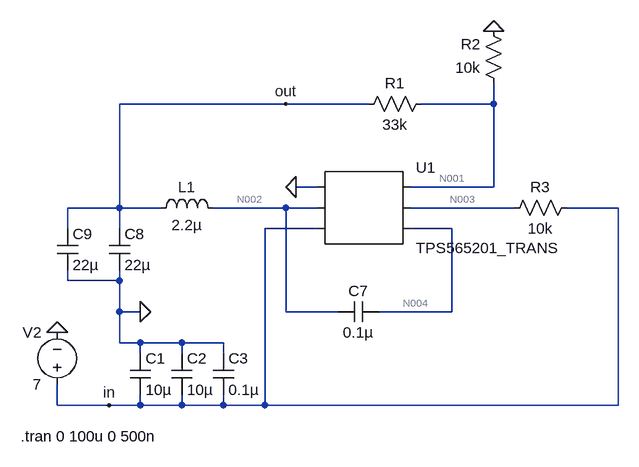
[diagram p0: schematic Voltage_Reg_3-3V.asc]
* Voltage_Reg_3-3V.asc
* U1: TPS565201_TRANS (symbol AutoGenerated\TPS565201_TRANS not available, pins judged from their places): pin1=0 pin2=N002 pin3=in pin4=N001 pin5=N003 pin6=N004
L1 out N002 2.2µ Rser=1u
C1 0 in 10µ
C2 0 in 10µ
C3 0 in 0.1µ
R3 in N003 10k
R1 N001 out 33k
C7 N004 N002 0.1µ
C9 out 0 22µ
C8 out 0 22µ
R2 N001 0 10k
V2 in 0 7
.tran 0 100u 0 500n
.backanno
.end

* Results of the author's LTspice run, read from the files saved beside the schematic
* Operating Point, zero values left out:
*   V(in) = 7 V
*   V(n003) = 7 V
*   V(n002) = 2.912 mV
*   V(n004) = 7 V
*   V(out) = 2.912 mV
*   V(n001) = 677.2 µV
*   I(L1) = -67.72 nA
*   I(R1) = -67.72 nA
*   I(R2) = 67.72 nA
*   I(V2) = -69.99 nA
*   Ix(u1:GND) = -7.28 nA
*   Ix(u1:SW) = -67.72 nA
*   Ix(u1:VIN) = 69.99 nA
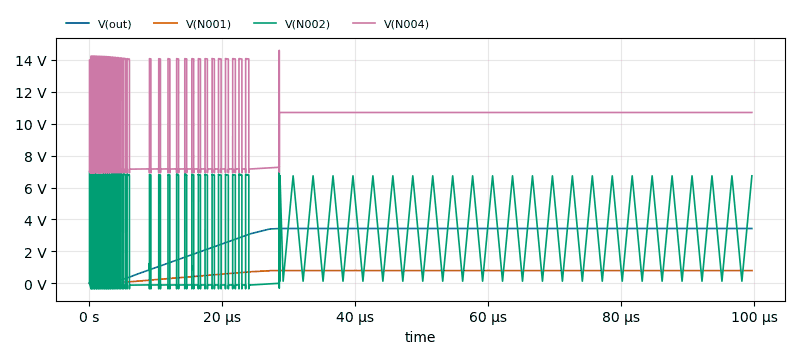
[diagram p1: Transient Analysis of Voltage_Reg_3-3V.asc, plotted from the saved traces]
* Transient Analysis, 1 run:
*   V(out): min 2.912 mV, max 3.434 V, average 2.923 V, rms 3.094 V, last 3.433 V
*   V(N001): min 677.2 µV, max 798.5 mV, average 679.7 mV, rms 719.5 mV, last 798.5 mV
*   V(N002): min -344.4 mV, max 7.326 V, average 2.923 V, rms 4.421 V, last 132.2 mV
*   V(N004): min 6.915 V, max 14.6 V, average 10.19 V, rms 10.35 V, last 10.7 V